# EAGLE design mega-shield2 (EAGLE 6.6.0)
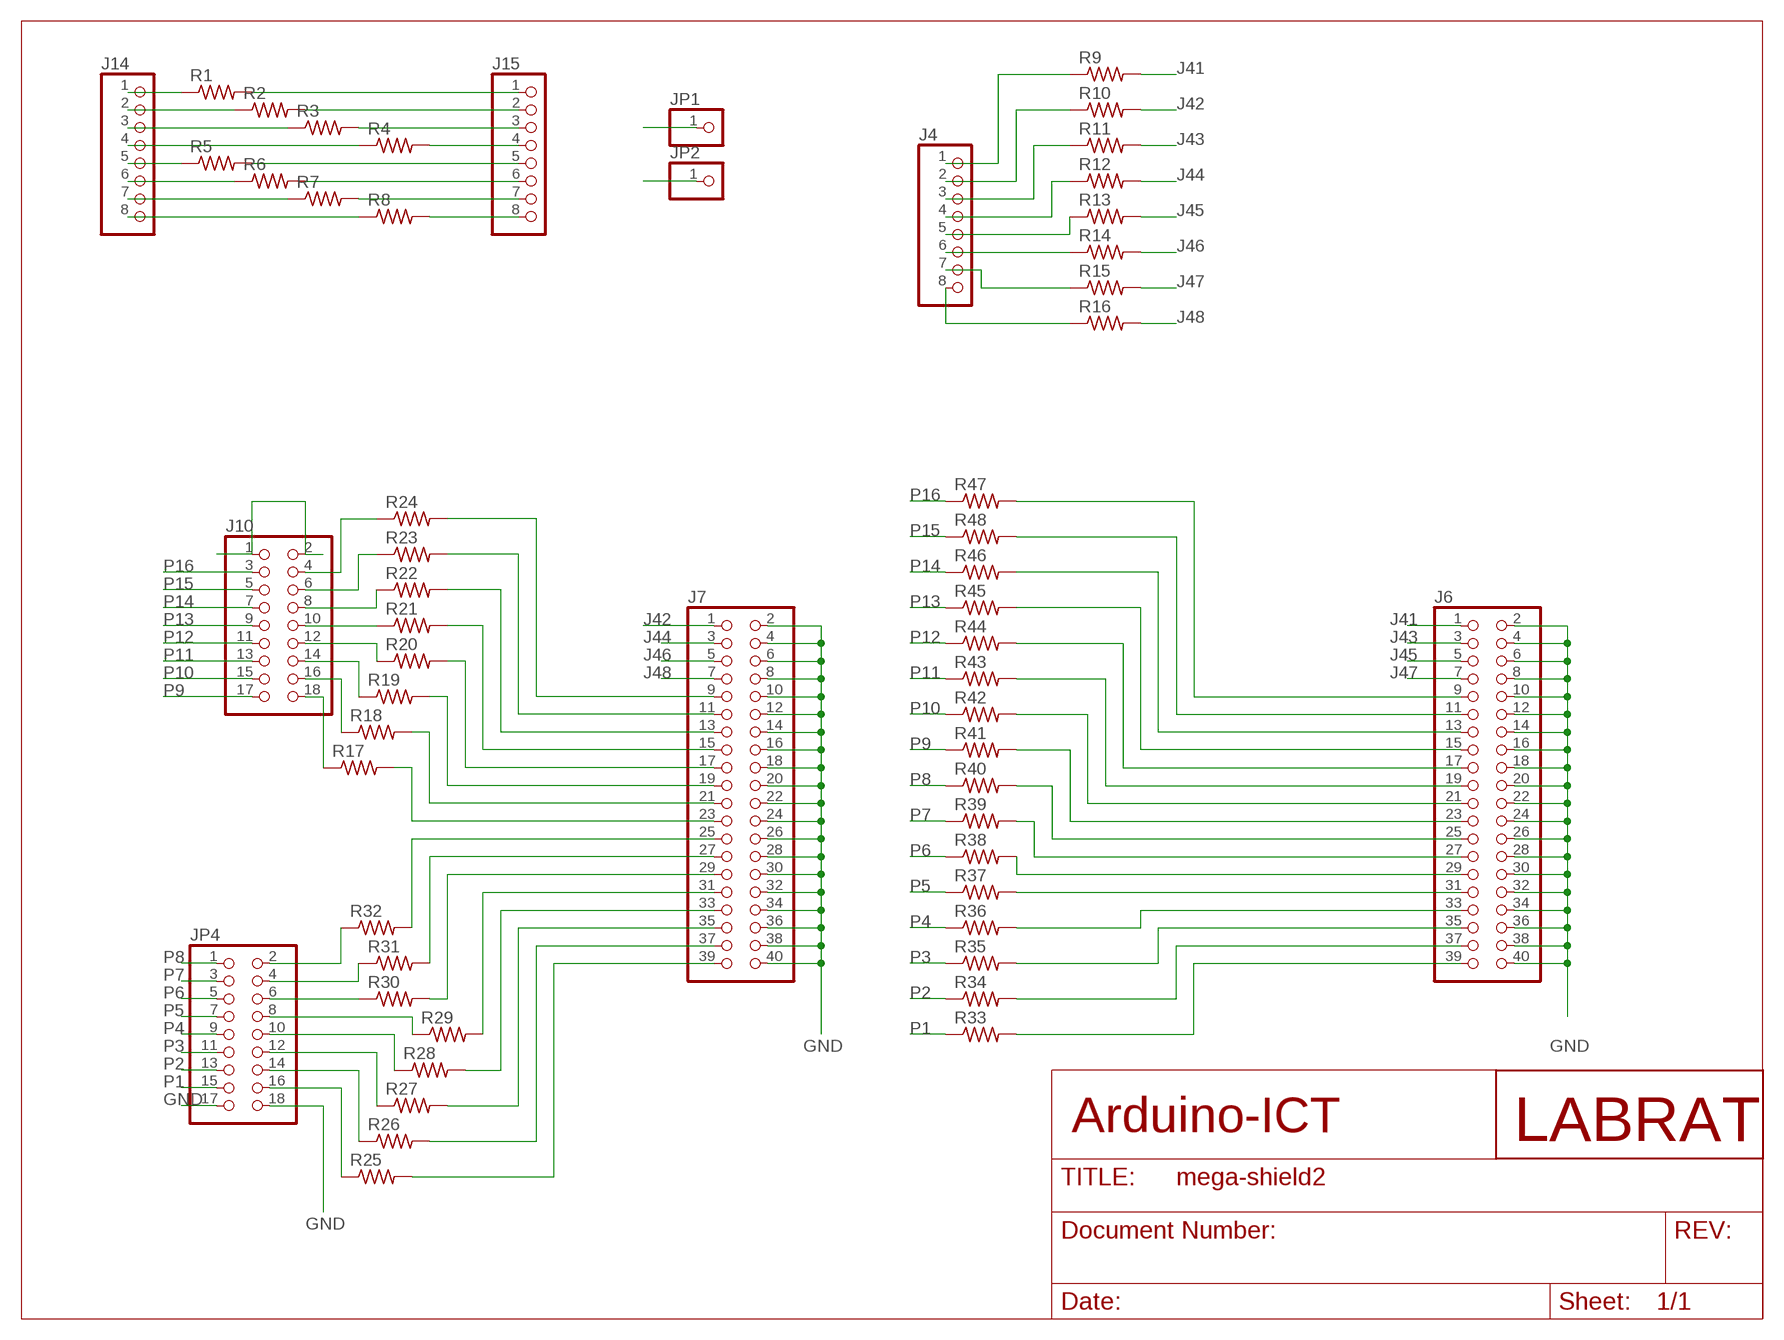
[diagram p0: schematic, sheet 1]

## Parts
J4  PINHD-1X8BIG  [1X08-BIG]
J6  PINHD-2X20  [2X20]
J7  PINHD-2X20  [2X20]
J10  PINHD-2X9-BIG  [2X09-BIG]
J14  PINHD-1X8BIG  [1X08-BIG]
J15  PINHD-1X8BIG  [1X08-BIG]
JP1  PINHD-1X1  [1X01]
JP2  PINHD-1X1  [1X01]
JP4  PINHD-2X9-BIG  [2X09-BIG]
R1  R-US_0204/5  [0204/5]
R2  R-US_0204/5  [0204/5]
R3  R-US_0204/5  [0204/5]
R4  R-US_0204/5  [0204/5]
R5  R-US_0204/5  [0204/5]
R6  R-US_0204/5  [0204/5]
R7  R-US_0204/5  [0204/5]
R8  R-US_0204/5  [0204/5]
R9  R-US_0204/5  [0204/5]
R10  R-US_0204/5  [0204/5]
R11  R-US_0204/5  [0204/5]
R12  R-US_0204/5  [0204/5]
R13  R-US_0204/5  [0204/5]
R14  R-US_0204/5  [0204/5]
R15  R-US_0204/5  [0204/5]
R16  R-US_0204/5  [0204/5]
R17  R-US_0204/5  [0204/5]
R18  R-US_0204/5  [0204/5]
R19  R-US_0204/5  [0204/5]
R20  R-US_0204/5  [0204/5]
R21  R-US_0204/5  [0204/5]
R22  R-US_0204/5  [0204/5]
R23  R-US_0204/5  [0204/5]
R24  R-US_0204/5  [0204/5]
R25  R-US_0204/5  [0204/5]
R26  R-US_0204/5  [0204/5]
R27  R-US_0204/5  [0204/5]
R28  R-US_0204/5  [0204/5]
R29  R-US_0204/5  [0204/5]
R30  R-US_0204/5  [0204/5]
R31  R-US_0204/5  [0204/5]
R32  R-US_0204/5  [0204/5]
R33  R-US_0204/5  [0204/5]
R34  R-US_0204/5  [0204/5]
R35  R-US_0204/5  [0204/5]
R36  R-US_0204/5  [0204/5]
R37  R-US_0204/5  [0204/5]
R38  R-US_0204/5  [0204/5]
R39  R-US_0204/5  [0204/5]
R40  R-US_0204/5  [0204/5]
R41  R-US_0204/5  [0204/5]
R42  R-US_0204/5  [0204/5]
R43  R-US_0204/5  [0204/5]
R44  R-US_0204/5  [0204/5]
R45  R-US_0204/5  [0204/5]
R46  R-US_0204/5  [0204/5]
R47  R-US_0204/5  [0204/5]
R48  R-US_0204/5  [0204/5]
U$1  LOGOLABRAT  [LOGO]

## Nets
GND: J6.2 J6.4 J6.6 J6.8 J6.10 J6.12 J6.14 J6.16 J6.18 J6.20 J6.22 J6.24 J6.26 J6.28 J6.30 J6.32 J6.34 J6.36 J6.38 J6.40 J7.2 J7.4 J7.6 J7.8 J7.10 J7.12 J7.14 J7.16 J7.18 J7.20 J7.22 J7.24 J7.26 J7.28 J7.30 J7.32 J7.34 J7.36 J7.38 J7.40 JP1.1 JP2.1 JP4.17 JP4.18
J41: J6.1 R9.2
J42: J7.1 R10.2
J43: J6.3 R11.2
J44: J7.3 R12.2
J45: J6.5 R13.2
J46: J7.5 R14.2
J47: J6.7 R15.2
J48: J7.7 R16.2
N$1: J14.1 R1.1
N$2: J15.1 R1.2
N$3: J14.2 R2.1
N$4: J14.3 R3.1
N$5: J14.4 R4.1
N$6: J14.5 R5.1
N$7: J14.6 R6.1
N$8: J14.7 R7.1
N$9: J14.8 R8.1
N$10: J15.2 R2.2
N$11: J15.3 R3.2
N$12: J15.4 R4.2
N$13: J15.5 R5.2
N$14: J15.6 R6.2
N$15: J15.7 R7.2
N$16: J15.8 R8.2
N$17: JP4.16 R25.1
N$18: J7.39 R25.2
N$19: JP4.14 R26.1
N$20: JP4.12 R27.1
N$21: JP4.10 R28.1
N$22: J7.37 R26.2
N$23: J7.35 R27.2
N$24: J7.33 R28.2
N$25: JP4.8 R29.1
N$26: JP4.6 R30.1
N$27: JP4.4 R31.1
N$28: JP4.2 R32.1
N$29: J7.31 R29.2
N$30: J7.29 R30.2
N$31: J7.27 R31.2
N$32: J7.25 R32.2
N$35: J7.23 R17.2
N$36: J7.21 R18.2
N$37: J7.19 R19.2
N$38: J7.17 R20.2
N$39: J10.18 R17.1
N$40: J10.16 R18.1
N$41: J10.14 R19.1
N$42: J10.12 R20.1
N$43: J10.10 R21.1
N$44: J10.8 R22.1
N$45: J10.6 R23.1
N$46: J10.4 R24.1
N$47: J7.15 R21.2
N$48: J7.13 R22.2
N$49: J7.11 R23.2
N$50: J7.9 R24.2
N$51: J10.1 J10.2
N$52: J4.8 R16.1
N$53: J4.7 R15.1
N$54: J4.6 R14.1
N$55: J4.5 R13.1
N$56: J4.4 R12.1
N$57: J4.3 R11.1
N$58: J4.2 R10.1
N$59: J4.1 R9.1
N$60: J6.39 R33.2
N$61: J6.37 R34.2
N$62: J6.35 R35.2
N$63: J6.33 R36.2
N$64: J6.31 R37.2
N$65: J6.29 R38.2
N$66: J6.27 R39.2
N$67: J6.25 R40.2
N$68: J6.23 R41.2
N$69: J6.21 R42.2
N$70: J6.19 R43.2
N$71: J6.17 R44.2
N$72: J6.15 R45.2
N$73: J6.13 R46.2
N$74: J6.11 R48.2
N$75: J6.9 R47.2
P1: JP4.15 R33.1
P2: JP4.13 R34.1
P3: JP4.11 R35.1
P4: JP4.9 R36.1
P5: JP4.7 R37.1
P6: JP4.5 R38.1
P7: JP4.3 R39.1
P8: JP4.1 R40.1
P9: J10.17 R41.1
P10: J10.15 R42.1
P11: J10.13 R43.1
P12: J10.11 R44.1
P13: J10.9 R45.1
P14: J10.7 R46.1
P15: J10.5 R48.1
P16: J10.3 R47.1

## Notes on the sheet
- Arduino-ICT

## Library data of the parts
J4 J14 J15 = adafruit:PINHD-1X8: PIN HEADER
J6 J7 = adafruit:PINHD-2X20: PIN HEADER
J10 JP4 = adafruit:PINHD-2X9: PIN HEADER With larger annulars
JP1 JP2 = pinhead:PINHD-1X1: PIN HEADER
R1-R48 = rcl:R-US_: RESISTOR, American symbol
U$1 = LabRats:LOGO

## Net classes
1 pwr: width 0.305 mm
2 raw: width 0.305 mm

## Board
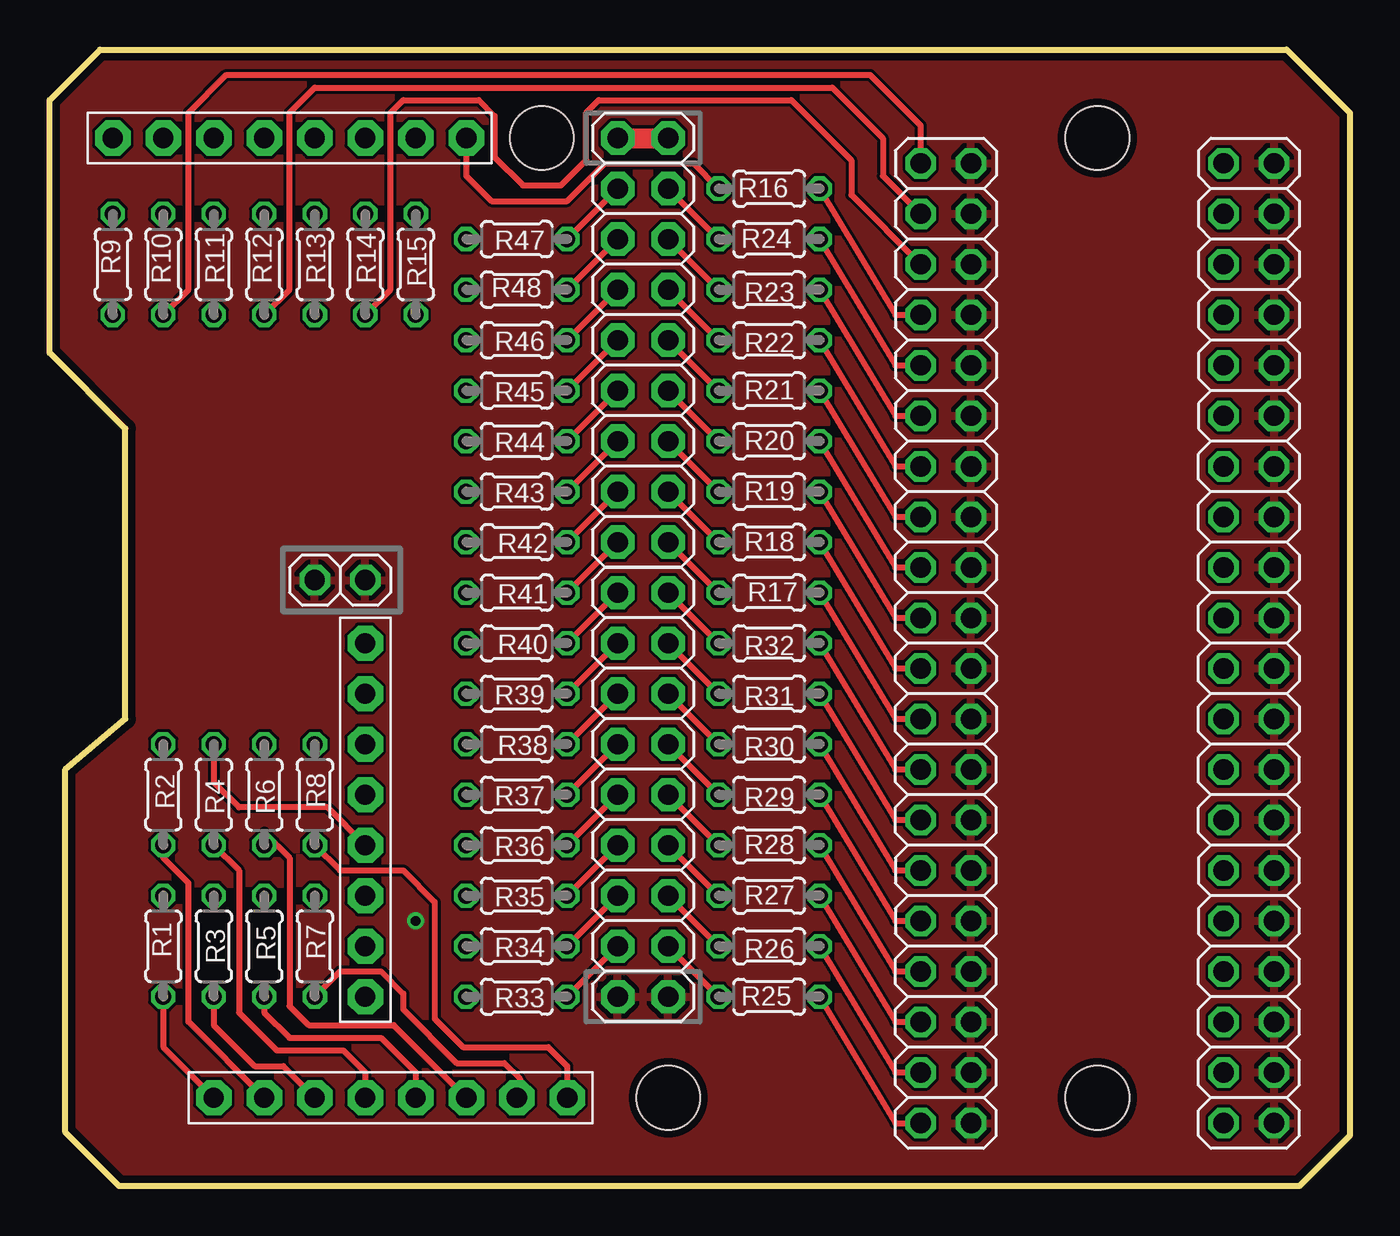
[diagram p1: board, top side]
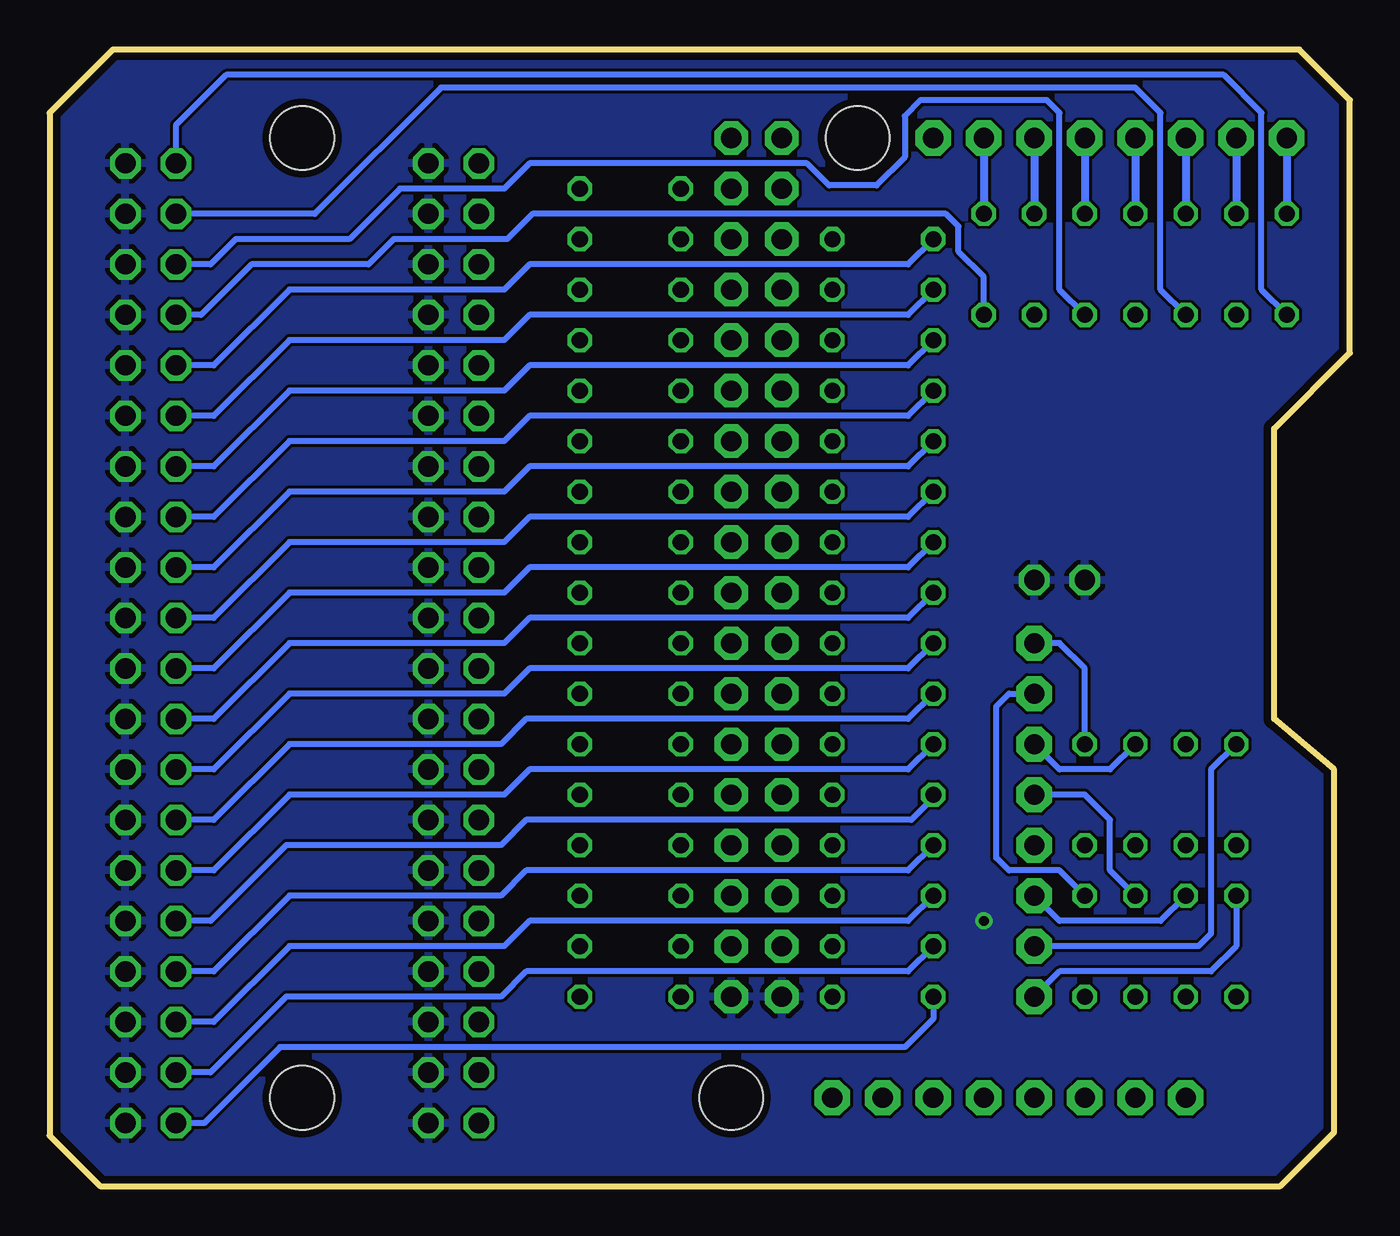
[diagram p2: board, bottom side, seen from below]

Size 65.41 x 57.15 mm. Coordinates in mm from the lower left corner, seen from the top.
Outline: 62.23,57.15 65.41,53.98 65.41,2.54 62.87,0 3.49,0 0.79,2.7 0.79,20.95 3.81,23.5 3.81,38.1 0,41.91 0,54.61 2.54,57.15 62.23,57.15
Copper layers (1*16): Top 0.0356mm / dielectric 1.5011mm / Bottom 0.0356mm
Design rules "LaenPCBOrder": minimum track width 6mil, minimum drill 13mil, track to track 6mil, track to pad 6mil, pad to pad 6mil, via to via 6mil, smd to smd 6mil, copper to edge 15mil, drill to drill 6mil, minimum pad ring 7mil, minimum via ring 7mil, stop-mask expansion 4mil, vias tented up to drill 0mil, thermal gap 10mil
Holes 3.2 mm at 24.76,52.7 31.11,4.45 52.71,52.7 52.71,4.45

### Footprints (pad centres in the part's own frame; a part is rotated, then mirrored left to right if it is on the bottom)
1X08-BIG = drill 1.016 pad 1.778 octagon: 1 -8.89,0; 2 -6.35,0; 3 -3.81,0; 4 -1.27,0; 5 1.27,0; 6 3.81,0; 7 6.35,0; 8 8.89,0
2X20 = drill 1.016 octagon: 1 -24.13,-1.27; 2 -24.13,1.27; 3 -21.59,-1.27; 4 -21.59,1.27; 5 -19.05,-1.27; 6 -19.05,1.27; 7 -16.51,-1.27; 8 -16.51,1.27; 9 -13.97,-1.27; 10 -13.97,1.27; 11 -11.43,-1.27; 12 -11.43,1.27; 13 -8.89,-1.27; 14 -8.89,1.27; 15 -6.35,-1.27; 16 -6.35,1.27; 17 -3.81,-1.27; 18 -3.81,1.27; 19 -1.27,-1.27; 20 -1.27,1.27; 21 1.27,-1.27; 22 1.27,1.27; 23 3.81,-1.27; 24 3.81,1.27; 25 6.35,-1.27; 26 6.35,1.27; 27 8.89,-1.27; 28 8.89,1.27; 29 11.43,-1.27; 30 11.43,1.27; 31 13.97,-1.27; 32 13.97,1.27; 33 16.51,-1.27; 34 16.51,1.27; 35 19.05,-1.27; 36 19.05,1.27; 37 21.59,-1.27; 38 21.59,1.27; 39 24.13,-1.27; 40 24.13,1.27
2X09-BIG = drill 1.016 pad 1.676 octagon: 1 -10.16,-1.27; 2 -10.16,1.27; 3 -7.62,-1.27; 4 -7.62,1.27; 5 -5.08,-1.27; 6 -5.08,1.27; 7 -2.54,-1.27; 8 -2.54,1.27; 9 0,-1.27; 10 0,1.27; 11 2.54,-1.27; 12 2.54,1.27; 13 5.08,-1.27; 14 5.08,1.27; 15 7.62,-1.27; 16 7.62,1.27; 17 10.16,-1.27; 18 10.16,1.27
1X01 = drill 1.016 octagon: 1 0,0
0204/5 = drill 0.813 octagon: 1 -2.54,0; 2 2.54,0

### Placement (x,y rotation side)
J4  12.06,52.7 0 top
J6  60.33,27.3 270 top
J7  45.09,27.3 270 top
J10  29.84,42.55 270 top
J14  15.88,18.41 90 top
J15  17.14,4.45 0 top
JP1  13.34,30.48 0 top
JP2  15.88,30.48 0 top
JP4  29.84,19.68 270 top
R1  5.71,12.06 270 top
R2  5.71,19.68 270 top
R3  8.26,12.06 270 top
R4  8.26,19.68 270 top
R5  10.79,12.06 270 top
R6  10.79,19.68 270 top
R7  13.34,12.06 270 top
R8  13.34,19.68 270 top
R9  3.17,46.35 270 top
R10  5.71,46.35 270 top
R11  8.26,46.35 270 top
R12  10.79,46.35 270 top
R13  13.34,46.35 270 top
R14  15.88,46.35 270 top
R15  18.41,46.35 270 top
R16  36.2,50.16 0 top
R17  36.2,29.84 0 top
R18  36.2,32.38 0 top
R19  36.2,34.92 0 top
R20  36.2,37.47 0 top
R21  36.2,40.01 0 top
R22  36.2,42.55 0 top
R23  36.2,45.09 0 top
R24  36.2,47.62 0 top
R25  36.2,9.53 0 top
R26  36.2,12.06 0 top
R27  36.2,14.61 0 top
R28  36.2,17.14 0 top
R29  36.2,19.68 0 top
R30  36.2,22.23 0 top
R31  36.2,24.77 0 top
R32  36.2,27.3 0 top
R33  23.49,9.53 180 top
R34  23.49,12.06 180 top
R35  23.49,14.61 180 top
R36  23.49,17.14 180 top
R37  23.49,19.68 180 top
R38  23.49,22.23 180 top
R39  23.49,24.77 180 top
R40  23.49,27.3 180 top
R41  23.49,29.84 180 top
R42  23.49,32.38 180 top
R43  23.49,34.92 180 top
R44  23.49,37.47 180 top
R45  23.49,40.01 180 top
R46  23.49,42.55 180 top
R47  23.49,47.62 180 top
R48  23.49,45.09 180 top
U$1  4.13,28.26 0 top

### Tracks (layer width: path | path; a pad name or v marks a point on that pad's centre or on a via)
GND  (via drill 0.5)
  other vias: 18.41,13.34
  pour Bottom: -0.64,57.78 -0.64,0 65.41,0 65.41,57.78
  pour Top: -0.64,57.63 -0.64,0 65.41,0 65.41,57.63
J41
  Bottom 0.305: R9.2 4.45,45.09 4.45,53.98 6.35,55.88 56.52,55.88 59.05,53.34 J6.1
J42
  Top 0.305: R10.2 6.99,45.09 6.99,53.98 8.89,55.88 41.27,55.88 43.82,53.34 J7.1
J43
  Bottom 0.305: R11.2 9.53,45.09 9.53,53.98 10.79,55.24 45.72,55.24 52.07,48.9 J6.3
J44
  Top 0.305: R12.2 12.06,45.09 12.06,53.98 13.34,55.24 39.37,55.24 41.91,52.7 41.91,50.8 J7.3
J45
  Bottom 0.305: R13.2 14.61,45.09 14.61,53.98 15.24,54.61 21.59,54.61 22.38,53.82 22.38,51.75 23.81,50.32 26.19,50.32 27.3,51.44 41.27,51.44 42.55,50.16 47.78,50.16 50.32,47.62 56.04,47.62 57.31,46.35 J6.5
J46
  Top 0.305: R14.2 17.14,45.09 17.14,53.98 17.78,54.61 21.59,54.61 22.38,53.82 22.38,51.75 23.81,50.32 25.72,50.32 26.99,51.59 26.99,53.98 27.62,54.61 37.31,54.61 40.32,51.59 40.32,49.85 J7.5
J47
  Bottom 0.305: R15.2 18.41,45.72 19.68,46.99 19.68,48.26 20.32,48.9 41.12,48.9 42.39,47.62 48.1,47.62 49.37,46.35 55.25,46.35 57.79,43.81 J6.7
J48
  Top 0.305: R16.2 42.55,43.81 J7.7
N$1
  Bottom 0.305: R1.1 5.71,12.06 6.99,10.79 14.61,10.79 J14.1
N$2
  Top 0.305: R1.2 5.71,6.99 J15.1
N$3
  Bottom 0.305: R2.1 6.99,20.95 6.99,12.7 7.62,12.06 J14.2
N$4
  Bottom 0.305: R3.1 9.53,13.34 14.61,13.34 J14.3
N$5
  Top 0.305: J14.4 13.97,19.05 9.53,19.05 8.26,20.32 R4.1
N$6
  Bottom 0.305: R5.1 12.06,15.88 12.06,18.41 13.34,19.68 J14.5
N$7
  Bottom 0.305: R6.1 12.06,20.95 14.61,20.95 J14.6
N$8
  Bottom 0.305: R7.1 14.61,15.88 17.14,15.88 17.78,16.51 17.78,24.13 17.14,24.77 J14.7
N$9
  Bottom 0.305: R8.1 13.34,26.04 14.61,27.3 J14.8
N$10
  Top 0.305: J15.2 6.99,8.26 6.99,15.24 5.71,16.51 R2.2
N$11
  Top 0.305: R3.2 8.26,8.1 10.32,6.03 11.75,6.03 J15.3
N$12
  Top 0.305: R4.2 9.53,15.88 9.53,8.73 11.43,6.83 14.76,6.83 15.88,5.71 J15.4
N$13
  Top 0.305: J15.5 18.41,5.71 16.67,7.46 12.06,7.46 10.79,8.73 R5.2
N$14
  Top 0.305: R6.2 10.79,17.78 12.06,16.51 12.06,9.05 13.02,8.1 17.3,8.1 J15.6
N$15
  Top 0.305: R7.2 14.61,10.79 16.67,10.79 17.78,9.68 17.78,8.89 20.48,6.19 22.86,6.19 23.65,5.4 23.65,4.6 J15.7
N$16
  Top 0.305: R8.2 14.61,15.88 17.78,15.88 19.37,14.29 19.37,8.41 20.8,6.99 25.08,6.99 26.04,6.03 J15.8
N$17
  Top 0.305: JP4.16 R25.1
N$18
  Top 0.305: R25.2 42.55,3.17 J7.39
N$19
  Top 0.305: JP4.14 R26.1
N$20
  Top 0.305: JP4.12 R27.1
N$21
  Top 0.305: JP4.10 R28.1
N$22
  Top 0.305: R26.2 42.55,5.71 J7.37
N$23
  Top 0.305: R27.2 42.55,8.26 J7.35
N$24
  Top 0.305: R28.2 42.55,10.79 J7.33
N$25
  Top 0.305: JP4.8 R29.1
N$26
  Top 0.305: JP4.6 R30.1
N$27
  Top 0.305: JP4.4 R31.1
N$28
  Top 0.305: JP4.2 R32.1
N$29
  Top 0.305: R29.2 42.55,13.34 J7.31
N$30
  Top 0.305: R30.2 42.55,15.88 J7.29
N$31
  Top 0.305: R31.2 42.55,18.41 J7.27
N$32
  Top 0.305: R32.2 42.55,20.95 J7.25
N$35
  Top 0.305: R17.2 42.55,23.5 J7.23
N$36
  Top 0.305: R18.2 42.55,26.04 J7.21
N$37
  Top 0.305: R19.2 42.55,28.57 J7.19
N$38
  Top 0.305: R20.2 42.55,31.11 J7.17
N$39
  Top 0.305: J10.18 R17.1
N$40
  Top 0.305: J10.16 R18.1
N$41
  Top 0.305: J10.14 R19.1
N$42
  Top 0.305: J10.12 R20.1
N$43
  Top 0.305: J10.10 R21.1
N$44
  Top 0.305: J10.8 R22.1
N$45
  Top 0.305: J10.6 R23.1
N$46
  Top 0.305: J10.4 R24.1
N$47
  Top 0.305: R21.2 42.55,33.66 J7.15
N$48
  Top 0.305: R22.2 42.55,36.2 J7.13
N$49
  Top 0.305: R23.2 42.55,38.73 J7.11
N$50
  Top 0.305: R24.2 42.55,41.27 J7.9
N$51
  Top 1.016: J10.1 J10.2
N$52
  Top 0.305: J4.8 20.95,50.8 22.22,49.53 26.04,49.53 27.94,51.44 32.39,51.44 R16.1
N$53
  Bottom 0.406: J4.7 R15.1
N$54
  Bottom 0.406: J4.6 R14.1
N$55
  Bottom 0.406: J4.5 R13.1
N$56
  Bottom 0.406: J4.4 R12.1
N$57
  Bottom 0.406: J4.3 R11.1
N$58
  Bottom 0.406: J4.2 R10.1
N$59
  Bottom 0.406: J4.1 R9.1
N$60
  Bottom 0.305: R33.2 20.95,8.41 22.38,6.99 53.82,6.99 57.63,3.17 J6.39
N$61
  Bottom 0.305: R34.2 22.22,10.79 41.43,10.79 42.7,9.53 53.5,9.53 57.31,5.71 J6.37
N$62
  Bottom 0.305: R35.2 22.22,13.34 41.27,13.34 42.55,12.06 53.34,12.06 57.15,8.26 J6.35
N$63
  Bottom 0.305: R36.2 22.22,15.88 41.43,15.88 42.7,14.61 53.34,14.61 57.15,10.79 J6.33
N$64
  Bottom 0.305: R37.2 20.95,19.53 22.07,18.41 41.43,18.41 42.7,17.14 53.5,17.14 57.31,13.34 J6.31
N$65
  Bottom 0.305: R38.2 22.22,20.95 41.27,20.95 42.55,19.68 53.34,19.68 57.15,15.88 J6.29
N$66
  Bottom 0.305: R39.2 22.22,23.5 41.43,23.5 42.7,22.23 53.34,22.23 57.15,18.41 J6.27
N$67
  Bottom 0.305: R40.2 22.22,26.04 41.27,26.04 42.55,24.77 53.34,24.77 57.15,20.95 J6.25
N$68
  Bottom 0.305: R41.2 22.22,28.57 41.27,28.57 42.55,27.3 53.34,27.3 57.15,23.5 J6.23
N$69
  Bottom 0.305: R42.2 22.22,31.11 41.27,31.11 42.55,29.84 53.34,29.84 57.15,26.04 J6.21
N$70
  Bottom 0.305: R43.2 22.22,33.66 41.27,33.66 42.55,32.38 53.34,32.38 57.15,28.57 J6.19
N$71
  Bottom 0.305: R44.2 22.22,36.2 41.27,36.2 42.55,34.92 53.34,34.92 57.15,31.11 J6.17
N$72
  Bottom 0.305: R45.2 22.22,38.73 41.27,38.73 42.55,37.47 53.34,37.47 57.15,33.66 J6.15
N$73
  Bottom 0.305: R46.2 22.22,41.27 41.27,41.27 42.55,40.01 53.34,40.01 57.15,36.2 J6.13
N$74
  Bottom 0.305: R48.2 22.22,43.81 41.27,43.81 42.55,42.55 53.34,42.55 57.15,38.73 J6.11
N$75
  Bottom 0.305: R47.2 22.22,46.35 41.27,46.35 42.55,45.09 53.34,45.09 57.15,41.27 J6.9
P1
  Top 0.305: R33.1 JP4.15
P2
  Top 0.305: R34.1 JP4.13
P3
  Top 0.305: R35.1 JP4.11
P4
  Top 0.305: R36.1 JP4.9
P5
  Top 0.305: R37.1 JP4.7
P6
  Top 0.305: JP4.5 R38.1
P7
  Top 0.305: JP4.3 R39.1
P8
  Top 0.305: JP4.1 R40.1
P9
  Top 0.305: J10.17 R41.1
P10
  Top 0.305: R42.1 J10.15
P11
  Top 0.305: R43.1 J10.13
P12
  Top 0.305: R44.1 J10.11
P13
  Top 0.305: R45.1 J10.9
P14
  Top 0.305: R46.1 J10.7
P15
  Top 0.305: R48.1 J10.5
P16
  Top 0.305: R47.1 J10.3

### Text on the board
tDocu: B | A | 5V | 40 | 1 | Layout by / LabRat | GND | 2020-12-09 | 8 | 9 | 10 | Arduino-ICT | 11 | Original Design: www.zzzaccaria.com | 12 | 13 | 14 | Arduino in Circuit Test Shield V1.10 (LabRat) | 15 | GND | 21 | 20
bDocu: Asteroids Use 0 Ohm straps | All Resistors 470 Ohms